# EAGLE design MPQ3426_3V7to12V (EAGLE 9.6.0)
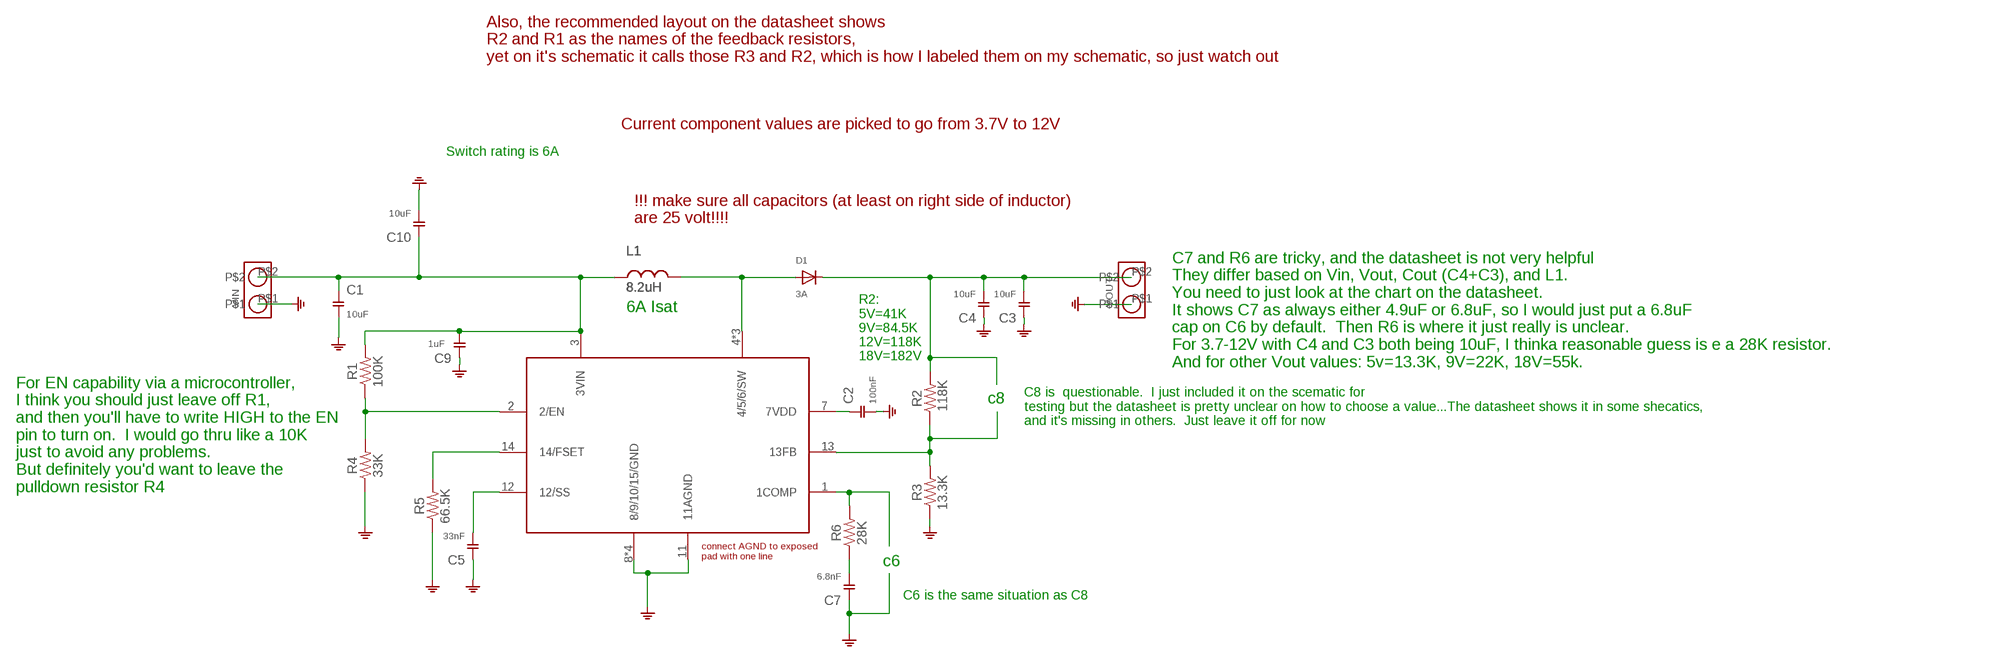
[diagram p0: schematic, sheet 1]

## Parts
C1  10uF  CAP_0805_NORMAL  [0805-NORMAL]
C2  100nF  CAP_0603  [0603_NORMAL]
C3  10uF  CAP_0805_NORMAL  [0805-NORMAL]
C4  10uF  CAP_0805_NORMAL  [0805-NORMAL]
C5  33nF  CAP_0603  [0603_NORMAL]
C7  6.8nF  CAP_0603  [0603_NORMAL]
C9  1uF  CAP_0603  [0603_NORMAL]
C10  10uF  CAP_0805_NORMAL  [0805-NORMAL]
D1  3A  DIODE_SOD-123FL  [SOD-123FL]
L1  8.2uH  INDUCTOR_LARGE_UNIVERSAL  [INDUCTOR_UNIVERSAL_LARGE]
R1  100K  RESISTOR_0603_TYPICAL  [0603_NORMAL]
R2  118K  RESISTOR_0603_TYPICAL  [0603_NORMAL]
R3  13.3K  RESISTOR_0603_TYPICAL  [0603_NORMAL]
R4  33K  RESISTOR_0603_TYPICAL  [0603_NORMAL]
R5  66.5K  RESISTOR_0603_TYPICAL  [0603_NORMAL]
R6  28K  RESISTOR_0603_TYPICAL  [0603_NORMAL]
U$1  MPQ3426  [MPQ3426]
VIN  HEADER_1X2_SQUARE_SMD  [1X2_.1"_2.54_SMD]
VOUT  HEADER_1X2_SQUARE_SMD  [1X2_.1"_2.54_SMD]

## Nets
GND: C1.2 C2.2 C3.1 C4.1 C5.1 C7.1 C9.1 C10.2 R3.1 R4.1 R5.1 U$1.8(8/9/10/15/GND) U$1.9(8/9/10/15/GND) U$1.10(8/9/10/15/GND) U$1.11(11AGND) U$1.P$1(8/9/10/15/GND) VIN.P$1 VOUT.P$1
N$2: D1.A L1.P$2 U$1.4(4/5/6/SW) U$1.5(4/5/6/SW) U$1.6(4/5/6/SW)
N$3: R1.1 R4.2 U$1.2(2/EN)
N$4: R5.2 U$1.14(14/FSET)
N$5: C5.2 U$1.12(12/SS)
N$6: C2.1 U$1.7(7VDD)
N$8: R2.1 R3.2 U$1.13(13FB)
N$9: R6.2 U$1.1(1COMP)
N$10: C7.2 R6.1
VIN: C1.1 C9.2 C10.1 L1.P$1 R1.2 U$1.3(3VIN) VIN.P$2
VOUT: C3.2 C4.2 D1.C R2.2 VOUT.P$2

## Notes on the sheet
- Also, the recommended layout on the datasheet shows
  R2 and R1 as the names of the feedback resistors, 
  yet on it's schematic it calls those R3 and R2, which is how I labeled them on my schematic, so just watch out
- Current component values are picked to go from 3.7V to 12V
- Switch rating is 6A
- !!! make sure all capacitors (at least on right side of inductor)
  are 25 volt!!!!
- 6A Isat
- R2:
  5V=41K 
  9V=84.5K
  12V=118K
  18V=182V
- C7 and R6 are tricky, and the datasheet is not very helpful
  They differ based on Vin, Vout, Cout (C4+C3), and L1.
  You need to just look at the chart on the datasheet.
  It shows C7 as always either 4.9uF or 6.8uF, so I would just put a 6.8uF
  cap on C6 by default.  Then R6 is where it just really is unclear.  
  For 3.7-12V with C4 and C3 both being 10uF, I thinka reasonable guess is e a 28K resistor.
  And for other Vout values: 5v=13.3K, 9V=22K, 18V=55k.
- c8
- C8 is  questionable.  I just included it on the scematic for
  testing but the datasheet is pretty unclear on how to choose a value...The datasheet shows it in some shecatics,
  and it's missing in others.  Just leave it off for now
- For EN capability via a microcontroller,
  I think you should just leave off R1,
  and then you'll have to write HIGH to the EN
  pin to turn on.  I would go thru like a 10K
  just to avoid any problems.
  But definitely you'd want to leave the
  pulldown resistor R4
- c6
- C6 is the same situation as C8

## Library data of the parts
C1 C3 C4 C10 = RonanLibrary:CAP_0805
C2 C5 C7 C9 = RonanLibrary:CAP_0603
D1 = RonanLibrary:DIODE
L1 = RonanLibrary:INDUCTOR
R1-R6 = RonanLibrary:RESISTOR_0603
U$1 = RonanLibrary:MPQ3426
VIN VOUT = RonanLibrary:HEADER_1X2

## Board
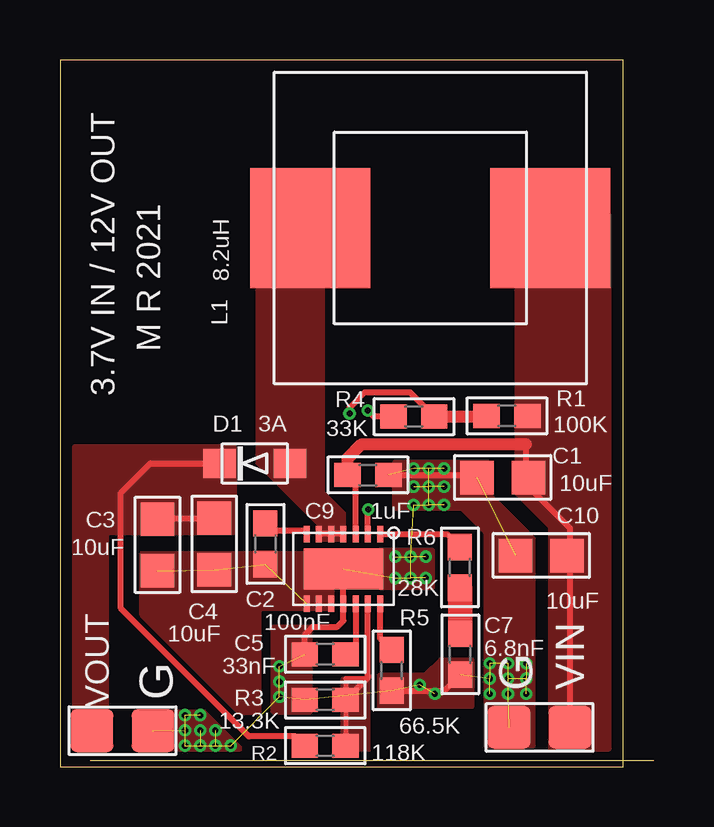
[diagram p1: board, top side]
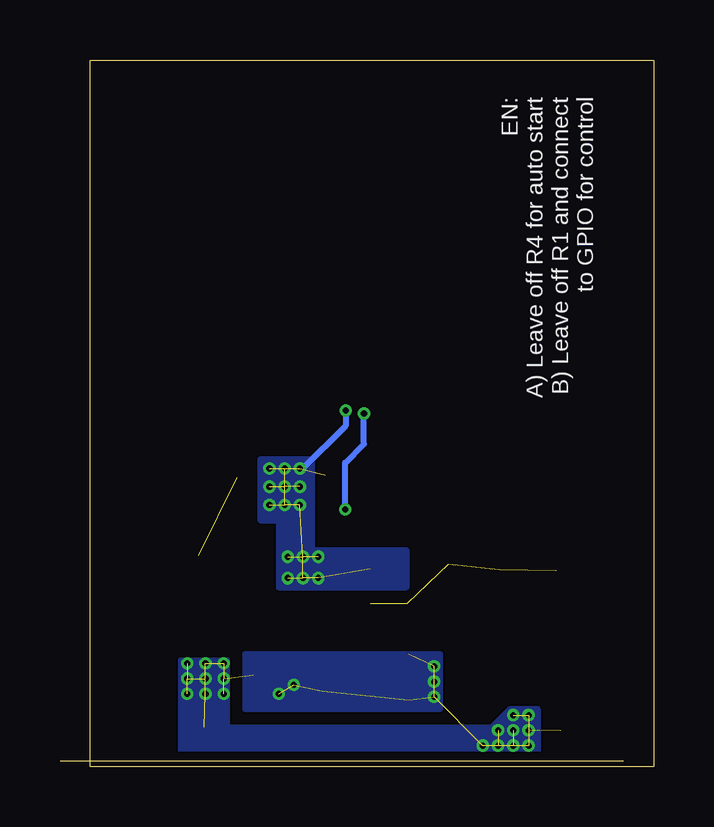
[diagram p2: board, bottom side, seen from below]

Size 24.73 x 29.48 mm. Coordinates in mm from the lower left corner, seen from the top.
Outline: 24.73,0.26 1.27,0.26
Outline: 0,0 23.46,0 23.46,29.48 0,29.48 0,0
Copper layers (1*16): Top 0.035559375mm / dielectric 1.6mm / Bottom 0.035559375mm
Design rules "oshpark-2layer *": minimum track width 6mil, minimum drill 10mil, track to track 6mil, track to pad 6mil, pad to pad 6mil, via to via 6mil, smd to smd 6mil, copper to edge 15mil, drill to drill 6mil, minimum pad ring 5mil, minimum via ring 5mil, stop-mask expansion 2.5mil, vias tented up to drill 15mil, thermal gap 10mil

### Footprints (pad centres in the part's own frame; a part is rotated, then mirrored left to right if it is on the bottom)
0805-NORMAL = smd 1.4 x 1.4: 1 -1.077,0; 2 1.077,0
0603_NORMAL = smd 1.1 x 1: 1 -0.85,0; 2 0.85,0
SOD-123FL = smd 1.35 x 1.22: A 1.462,0; C -1.462,0
INDUCTOR_UNIVERSAL_LARGE = smd 5 x 5: P$1 0,5; P$2 0,-5
MPQ3426 = smd 0.7 x 0.25: 1 -1.45,1.525; 2 -1.45,1.015; 3 -1.45,0.505; 4 -1.45,0; 5 -1.45,-0.51; 6 -1.45,-1.02; 7 -1.45,-1.525; 8 1.45,-1.525; 9 1.45,-1.02; 10 1.45,-0.51; 11 1.45,0; 12 1.45,0.505; 13 1.45,1.015; 14 1.45,1.525 | smd 1.7 x 3.3: P$1 0,0
1X2_.1"_2.54_SMD = smd 1.778 x 1.778: P$1 -1.27,0; P$2 1.27,0

### Placement (x,y rotation side)
C1  18.45,12.06 180 top
C2  8.56,9.3 270 top
C3  4.06,9.26 90 top
C4  6.43,9.3 90 top
C5  11.05,4.7 0 top
C7  16.68,4.7 90 top
C9  12.83,12.17 180 top
C10  20.05,8.81 180 top
D1  8.11,12.65 0 top
L1  15.43,22.46 270 top
R1  18.62,14.64 0 top
R2  11.05,0.89 180 top
R3  11.05,2.79 0 top
R4  14.75,14.6 0 top
R5  13.82,4.03 90 top
R6  16.66,8.32 90 top
U$1  11.81,8.26 270 top
VIN  19.98,1.65 0 top
VOUT  2.6,1.51 180 top

### Tracks (layer width: path | path; a pad name or v marks a point on that pad's centre or on a via)
GND  (via drill 0.25)  (50 unrouted)
  Top 0.254: C5.1 10.2,5.5 10.54,5.84 11.56,5.84 11.81,6.1 U$1.11 U$1.P$1 | C9.1 17.37,12.17 C1.2 | R4.1 13.08,14.6 v12.83,14.86 | R5.1 16.01,3.18 C7.1
  Bottom 0.254: v14.73,12.45 14.61,12.45 12.83,14.22 v12.83,14.86
  other vias: 9.14,4.19 9.14,3.56 9.14,2.92 14.99,3.43 15.62,3.05 15.37,12.45 15.37,11.68 15.37,10.92 13.97,8.76 13.97,7.87 14.61,8.76 15.24,8.76 14.61,7.87 15.24,7.87 14.73,11.68 14.73,10.92 5.21,2.16 5.21,1.52 5.21,0.89 5.84,2.16 5.84,1.52 5.84,0.89 6.48,1.52 6.48,0.89 7.11,0.89 16,12.45 16,11.68 16,10.92 17.91,4.32 17.91,3.68 17.91,3.05 19.43,3.05 19.43,3.68 19.43,4.32 18.67,4.32 18.67,3.68 18.67,3.05
  pour Top (no thermals): 10.41,2.29 8.89,2.29 8.89,5.84 10.41,5.84
  pour Bottom: 8.89,4.7 17.02,4.7 17.02,2.41 8.89,2.41
  pour Top (no thermals): 13.97,12.7 17.78,12.7 17.78,11.43 19.68,9.53 19.68,0.89 17.78,0.89 17.78,9.78 16.76,10.79 13.97,10.79
  pour Top (no thermals): 13.34,9.02 15.49,9.02 15.49,7.49 13.34,7.49
  pour Top (no thermals): 11.3,8.89 11.3,6.6 8.26,6.6 8.26,2.29 7.49,2.29 3.43,6.35 3.43,8.89
  pour Top (no thermals): 3.17,2.29 5.97,2.29 7.49,0.76 3.17,0.76
  pour Bottom: 14.22,12.83 16.38,12.83 16.38,10.29 15.62,10.29 15.62,7.49 10.29,7.49 10.29,9.02 14.22,9.02
  pour Bottom: 4.83,2.41 4.83,0.63 19.68,0.63 19.68,4.45 17.78,4.45 17.78,1.65 6.73,1.65 5.97,2.41
  pour Top (no thermals): 13.34,3.81 15.24,3.81 15.88,4.45 17.14,4.45 17.14,2.54 13.34,2.54
N$2
  Top 0.254: U$1.4 U$1.5 U$1.6
  pour Top (no thermals): 10.79,9.53 11.81,9.53 11.81,10.54 10.92,11.43 10.92,22.99 8.26,22.99 8.26,12.7 10.79,10.16
N$3  (via drill 0.25)
  Top 0.254: U$1.2 12.83,10.67 12.85,10.69 v12.85,10.73 | v12.06,14.73 12.06,14.99 12.7,15.62 14.58,15.62 R4.2
  Top 0.508: R4.2 17.74,14.6 R1.1
  Bottom 0.254: v12.06,14.73 12.06,13.46 12.85,12.68 v12.85,10.73
N$4
  Top 0.254: R5.2 13.34,5.37 U$1.14
N$5
  Top 0.254: U$1.12 12.32,5.12 C5.2
N$6
  Top 0.254: U$1.7 10.16,9.83 8.88,9.83 C2.1
N$8
  Top 0.203: 12.83,3.68 11.9,3.68 R3.2 R2.1
  Top 0.254: U$1.13 12.83,3.81 12.83,3.72 R3.2
  pour Top (no thermals): 11.81,3.68 12.83,3.68 12.83,0 11.81,0
N$9
  Top 0.254: U$1.1 16.13,9.71 R6.2
N$10
  Top 1.016: R6.1 16.68,7.45 C7.2
VIN
  Top 0.254: U$1.3 12.32,12.17 C9.2 | VIN.P$2 21.25,9.95 19.41,11.79 19.41,12.17 | 19.41,12.17 C1.1 | 19.41,13.46 19.41,12.17
  Top 0.508: C9.2 11.98,12.87 12.57,13.46 19.41,13.46
  pour Top (no thermals): 19.05,11.43 20.45,10.03 20.45,0.76 22.86,0.76 22.86,22.99 19.05,22.99
VOUT
  Top 0.254: D1.C 3.76,12.65 2.54,11.43 2.54,6.6 7.87,1.27 9.82,1.27 R2.2 | C4.2 6.38,10.33 C3.2
  pour Top (no thermals): 7.24,13.33 7.24,9.78 1.91,9.78 1.91,1.27 0.64,1.27 0.64,13.33

### Text on the board
tNames: 3.7V IN / 12V OUT | M R 2021 | G | G
bNames: EN: / A) Leave off R4 for auto start / B) Leave off R1 and connect / to GPIO for control